# Altium schematic sheet ShutdownDPDT-S05-V00-SegmentGroup.SchDoc
size A4; SheetNumber: 4; SheetTotal: 4
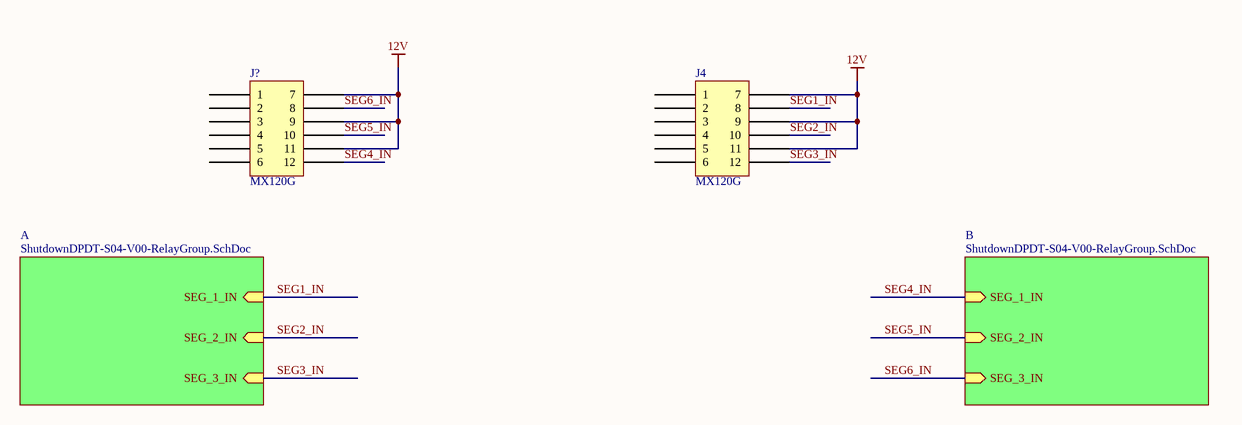
[diagram p0: ShutdownDPDT-S05-V00-SegmentGroup.SchDoc]

## Parts
J4  MX120G  [MX120G]
J?  MX120G  [MX120G]

## Sub-sheets
A = ShutdownDPDT-S04-V00-RelayGroup.SchDoc: SEG_1_IN (in), SEG_2_IN (in), SEG_3_IN (in)
B = ShutdownDPDT-S04-V00-RelayGroup.SchDoc: SEG_1_IN (in), SEG_2_IN (in), SEG_3_IN (in)

## Nets
12V: J4.7 J4.9 J4.11 J?.7 J?.9 J?.11
SEG1_IN: J4.8 ; sheet A/SEG_1_IN
SEG2_IN: J4.10 ; sheet A/SEG_2_IN
SEG3_IN: J4.12 ; sheet A/SEG_3_IN
SEG4_IN: J?.12 ; sheet B/SEG_1_IN
SEG5_IN: J?.10 ; sheet B/SEG_2_IN
SEG6_IN: J?.8 ; sheet B/SEG_3_IN

Not connected (* = marked no-connect by the designer): J4 1 2 3 4 5 6; J? 1 2 3 4 5 6

## Library data of the parts
J4 J? = MX120G: MX120G with standard connector layout